# Altium project SPI LVDS Master.PrjPcb
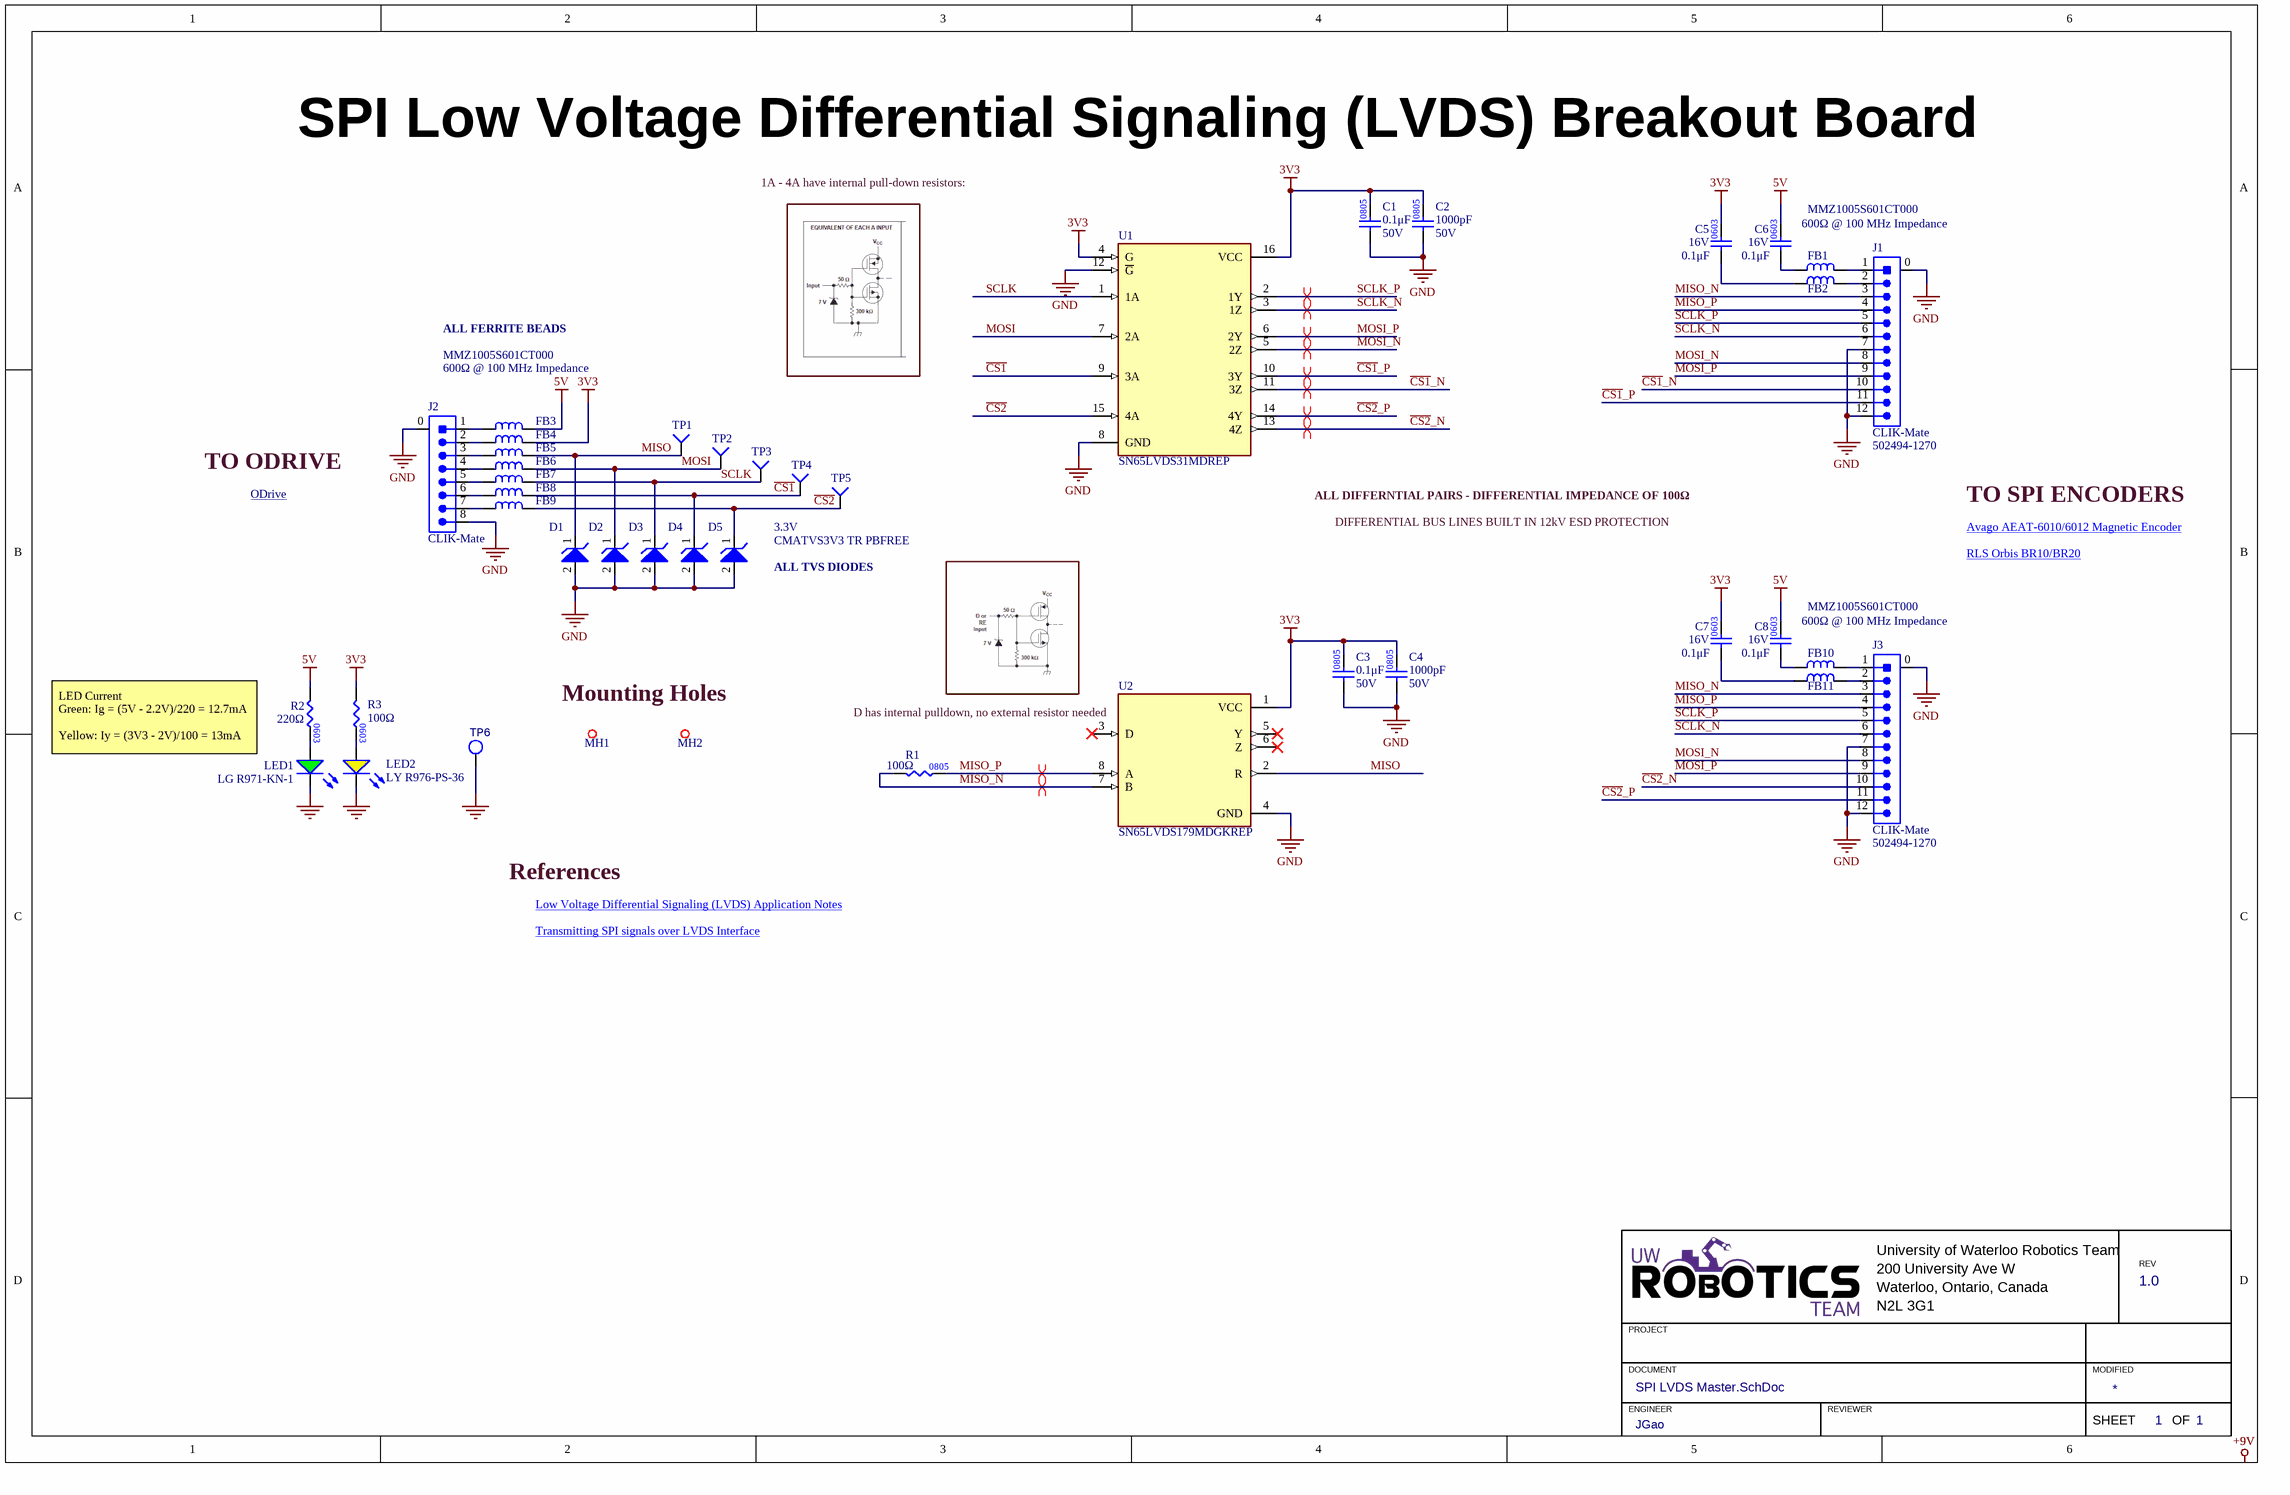
[diagram p0: SPI LVDS Master.SchDoc]
Engineer: JGao; Revision: 1.0
1 sheet, 42 parts. Net scope: global (net labels, ports and power ports of the same name join across sheets).
Board file: SPI LVDS Master.PcbDoc

## Sheet SPI LVDS Master.SchDoc: SPI Low Voltage Differential Signaling (LVDS) Breakout Board
size 431 x 279 mm; Engineer: JGao; Organization: TESLA Motors, INC; Address1: 3500 Deer Creek Road; Address2: Palo Alto, CA; Address4: U.S.A.; SheetNumber: 1; SheetTotal: 1

### Parts
C1  value 0.1μF  Voltage Rating: 50V  [CAP2012]  (hidden comment: CAP_0.1uF_50V_0805)
C2  value 1000pF  Voltage Rating: 50V  [CAP2012]  (hidden comment: CAP_1000pF_50V_0805)
C3  value 0.1μF  Voltage Rating: 50V  [CAP2012]  (hidden comment: CAP_0.1uF_50V_0805)
C4  value 1000pF  Voltage Rating: 50V  [CAP2012]  (hidden comment: CAP_1000pF_50V_0805)
C5  value 0.1μF  Voltage Rating: 16V  [CAP0603]  (hidden comment: CAP_0.1uF_16V_0603)
C6  value 0.1μF  Voltage Rating: 16V  [CAP0603]  (hidden comment: CAP_0.1uF_16V_0603)
C7  value 0.1μF  Voltage Rating: 16V  [CAP0603]  (hidden comment: CAP_0.1uF_16V_0603)
C8  value 0.1μF  Voltage Rating: 16V  [CAP0603]  (hidden comment: CAP_0.1uF_16V_0603)
D1  Voltage - Reverse Standoff (Typ): 3.3V  Manufacturer Part Number 1: CMATVS3V3 TR PBFREE  [SOD-923]  (hidden comment: TVS_DIODE_UNIDIR_3.3V_7A)
D2  TVS_DIODE_UNIDIR_3.3V_7A  [SOD-923]  (value not drawn)
D3  TVS_DIODE_UNIDIR_3.3V_7A  [SOD-923]  (value not drawn)
D4  TVS_DIODE_UNIDIR_3.3V_7A  [SOD-923]  (value not drawn)
D5  TVS_DIODE_UNIDIR_3.3V_7A  [SOD-923]  (value not drawn)
FB1  Manufacturer Part Number 1: MMZ1005S601CT000  [RES0402]  (hidden comment: FERRITE_BEAD_600OHM_0402)
FB2  FERRITE_BEAD_600OHM_0402  [RES0402]  (value not drawn)
FB3  Manufacturer Part Number 1: MMZ1005S601CT000  [RES0402]  (hidden comment: FERRITE_BEAD_600OHM_0402)
FB4  FERRITE_BEAD_600OHM_0402  [RES0402]  (value not drawn)
FB5  FERRITE_BEAD_600OHM_0402  [RES0402]  (value not drawn)
FB6  FERRITE_BEAD_600OHM_0402  [RES0402]  (value not drawn)
FB7  FERRITE_BEAD_600OHM_0402  [RES0402]  (value not drawn)
FB8  FERRITE_BEAD_600OHM_0402  [RES0402]  (value not drawn)
FB9  FERRITE_BEAD_600OHM_0402  [RES0402]  (value not drawn)
FB10  Manufacturer Part Number 1: MMZ1005S601CT000  [RES0402]  (hidden comment: FERRITE_BEAD_600OHM_0402)
FB11  FERRITE_BEAD_600OHM_0402  [RES0402]  (value not drawn)
J1  Family: CLIK-Mate  Supplier Part Number 1: 502494-1270  [MOLEX-5024941270]  (hidden comment: CON_12M_SM_RA_2mm)
J2  Family: CLIK-Mate  [MOLEX-5025850870]  (hidden comment: CON_8M_SM_RA)
J3  Family: CLIK-Mate  Supplier Part Number 1: 502494-1270  [MOLEX-5024941270]  (hidden comment: CON_12M_SM_RA_2mm)
LED1  Manufacturer Part Number 1: LG R971-KN-1  [LED_0805_GREEN]  (hidden comment: LED_GREEN)
LED2  Manufacturer Part Number 1: LY R976-PS-36  [LED_0805_YELLOW]  (hidden comment: LED_YELLOW)
MH1  MOUNTING_HOLE_M3  [MOUNTING_HOLE_3mm]  (value not drawn)  (no BOM)
MH2  MOUNTING_HOLE_M3  [MOUNTING_HOLE_3mm]  (value not drawn)  (no BOM)
R1  value 100Ω  [RES0805]  (hidden comment: RES_100Ω_0805_1%)
R2  value 220Ω  [RES0603]  (hidden comment: RES_220Ω_0603_5%)
R3  value 100Ω  [RES0603]  (hidden comment: RES_100Ω_0603_1%)
TP1  TESTPOINT_1MM_SQUARE  [TESTPOINT_SQUARE_1MM]  (value not drawn)  (no BOM)
TP2  TESTPOINT_1MM_SQUARE  [TESTPOINT_SQUARE_1MM]  (value not drawn)  (no BOM)
TP3  TESTPOINT_1MM_SQUARE  [TESTPOINT_SQUARE_1MM]  (value not drawn)  (no BOM)
TP4  TESTPOINT_1MM_SQUARE  [TESTPOINT_SQUARE_1MM]  (value not drawn)  (no BOM)
TP5  TESTPOINT_1MM_SQUARE  [TESTPOINT_SQUARE_1MM]  (value not drawn)  (no BOM)
TP6  TESTPOINT_LOOP  [TESTPOINT_LOOP]  (value not drawn)
U1  SN65LVDS31MDREP  [SOIC127P600X175-16N]
U2  SN65LVDS179MDGKREP  [SOP65P490X110-8N]

### Nets
3V3: C1.2 C2.2 C3.2 C4.2 C5.2 C7.2 FB4.2 R3.1 U1.4(G) U1.16(VCC) U2.1(VCC)
5V: C6.2 C8.2 FB3.2 R2.1
GND: C1.1 C2.1 C3.1 C4.1 D1.2 D2.2 D3.2 D4.2 D5.2 J1.0 J1.7 J1.12 J2.0 J2.8 J3.0 J3.7 J3.12 LED1.2(K) LED2.2(K) TP6.1 U1.8(GND) U1.12(~{G}) U2.4(GND)
~{CS1}: D4.1 FB8.2 TP4.1(=value) U1.9(3A)
~{CS1}_N: J1.10 U1.11(3Z)
~{CS1}_P: J1.11 U1.10(3Y)
~{CS2}: D5.1 FB9.2 TP5.1(=value) U1.15(4A)
~{CS2}_N: J3.10 U1.13(4Z)
~{CS2}_P: J3.11 U1.14(4Y)
MISO: D1.1 FB5.2 TP1.1(=value) U2.2(R)
MISO_N: J1.3 J3.3 R1.1 U2.7(B)
MISO_P: J1.4 J3.4 R1.2 U2.8(A)
MOSI: D2.1 FB6.2 TP2.1(=value) U1.7(2A)
MOSI_N: J1.8 J3.8 U1.5(2Z)
MOSI_P: J1.9 J3.9 U1.6(2Y)
SCLK: D3.1 FB7.2 TP3.1(=value) U1.1(1A)
SCLK_N: J1.6 J3.6 U1.3(1Z)
SCLK_P: J1.5 J3.5 U1.2(1Y)
NetC5_1: C5.1 FB2.2
NetC6_1: C6.1 FB1.2
NetC7_1: C7.1 FB11.2
NetC8_1: C8.1 FB10.2
NetFB1_1: FB1.1 J1.1
NetFB2_1: FB2.1 J1.2
NetFB3_1: FB3.1 J2.1
NetFB4_1: FB4.1 J2.2
NetFB5_1: FB5.1 J2.3
NetFB6_1: FB6.1 J2.4
NetFB7_1: FB7.1 J2.5
NetFB8_1: FB8.1 J2.6
NetFB9_1: FB9.1 J2.7
NetFB10_1: FB10.1 J3.1
NetFB11_1: FB11.1 J3.2
NetLED1_1: LED1.1(A) R2.2
NetLED2_1: LED2.1(A) R3.2

Not connected (* = marked no-connect by the designer): U2 3(D)* 5(Y)* 6(Z)*

### Layout directives
differential pair: MISO_N, MISO_P, MOSI_N, MOSI_P, SCLK_N, SCLK_P, ~{CS1}_N, ~{CS1}_P, ~{CS2}_N, ~{CS2}_P

### Notes on the sheet
- 1A - 4A have internal pull-down resistors:
- (near C6) 600Ω @ 100 MHz Impedance
- ALL FERRITE BEADS
- 600Ω @ 100 MHz Impedance
- TO ODRIVE
- ALL DIFFERNTIAL PAIRS - DIFFERENTIAL IMPEDANCE OF 100Ω
- ODrive <https://odriverobotics.com/>
- DIFFERENTIAL BUS LINES BUILT IN 12kV ESD PROTECTION
- TO SPI ENCODERS
- Avago AEAT-6010/6012 Magnetic Encoder <https://www.mouser.ca/datasheet/2/678/av02_0188en-1855336.pdf>
- RLS Orbis BR10/BR20 <https://www.rls.si/eng/fileuploader/download/download/?d=1&file=custom%2Fupload%2FBRD01_08_EN_data_sheet.pdf>
- (near D5) ALL TVS DIODES
- (near C8) 600Ω @ 100 MHz Impedance
- LED Current
  Green: Ig = (5V - 2.2V)/220 = 12.7mA
  Yellow: Iy = (3V3 - 2V)/100 = 13mA
- Mounting Holes
- (near U2) D has internal pulldown, no external resistor needed
- References
- Low Voltage Differential Signaling (LVDS) Application Notes <https://www.ti.com/lit/an/slla014a/slla014a.pdf?ts=1641520445544>
- Transmitting SPI signals over LVDS Interface <https://www.ti.com/lit/ug/tidued8/tidued8.pdf?ts=1641492246613>
- University of Waterloo Robotics Team
- 200 University Ave W
- REV
- PROJECT
- Waterloo, Ontario, Canada
- N2L 3G1
- DOCUMENT
- ENGINEER
- REVIEWER
- MODIFIED
- SHEET
- OF
- (in symbol RES_100Ω_0603_1%) 0603

### Library data of the parts
C1 C3 = CAP_0.1uF_50V_0805: CAP CER 0.1UF 50V X7R 0805; Manufacturer 1: Murata Electronics; Manufacturer Part Number 1: GCM21BR71H104KA37K; Package/Footprint: 0805; Mounting Type: SMD; Supplier 1: Digi-Key; Supplier Part Number 1: 490-8049-1-ND; Dielectric: X7R; LCSC Part #: C49678
C2 C4 = CAP_1000pF_50V_0805: CAP CER 1000pF 50V X7R 0805; Manufacturer 1: Samsung; Manufacturer Part Number 1: CL21B102KBANNNC; Package/Footprint: 0805; Supplier 1: Digi-Key; Mounting Type: SMD; Supplier Part Number 1: 1276-1020-1-ND; Dielectric: X7R
C5-C8 = CAP_0.1uF_16V_0603: CAP CER 0.1UF 16V X7R 0603; Manufacturer Part Number 1: CC0603KRX7R7BB104; Manufacturer 1: Yageo; Package: 0603; Supplier Part Number 1: 311-1088-1-ND; Supplier 1: Digi-Key; Dielectric: X7R
D1 = TVS_DIODE_UNIDIR_3.3V_7A: TVS DIODE 3.3VWM 11VC SOD923; Manufacturer 1: Central Semiconductor Corp; Voltage - Breakdown (Min): 5V; Voltage - Clamping (Max) @ Ipp: 11V; Mounting Type: SMD; Package/Footprint: SOD-923; Supplier 1: Digi-Key; Supplier Part Number 1: 1514-CMATVS3V3TRPBFREECT-ND
D2-D5 = TVS_DIODE_UNIDIR_3.3V_7A: TVS DIODE 3.3VWM 11VC SOD923; Manufacturer 1: Central Semiconductor Corp; Manufacturer Part Number 1: CMATVS3V3 TR PBFREE; Voltage - Breakdown (Min): 5V; Voltage - Clamping (Max) @ Ipp: 11V; Voltage - Reverse Standoff (Typ): 3.3V; Mounting Type: SMD; Package/Footprint: SOD-923; Supplier 1: Digi-Key; Supplier Part Number 1: 1514-CMATVS3V3TRPBFREECT-ND
FB1 FB3 FB10 = FERRITE_BEAD_600OHM_0402: FIXED IND 1UH 3.8A 33 MOHM SMD; Manufacturer 1: TDK Corporation; DC Resistance (DCR) (Max): 520mΩ; Current Rating (Max): 300mA; Impedance @ Frequency: 600Ω @ 100 MHz; Impedance: 600Ω; Supplier Part Number 1: 445-2162-1-ND; Supplier 1: Digi-Key; Mounting Type: SMD; Package/Footprint: SMD; Package: 0402
FB2 FB4-FB9 FB11 = FERRITE_BEAD_600OHM_0402: FIXED IND 1UH 3.8A 33 MOHM SMD; Manufacturer 1: TDK Corporation; Manufacturer Part Number 1: MMZ1005S601CT000; DC Resistance (DCR) (Max): 520mΩ; Current Rating (Max): 300mA; Impedance @ Frequency: 600Ω @ 100 MHz; Impedance: 600Ω; Supplier Part Number 1: 445-2162-1-ND; Supplier 1: Digi-Key; Mounting Type: SMD; Package/Footprint: SMD; Package: 0402
J1 J3 = CON_12M_SM_RA_2mm: 2.00mm Pitch CLIK-Mate Wire-to-Board PCB Receptacle, Single Row, Right-Angle, 12 Circuits; Manufacturer: Molex; Number of Contacts: 12; Contact Resistance: 20mR; Current Rating: 3A; Mating Cycles: 30; Voltage Rating (AC): 250V; Insulation Resistance: 1GR; Pitch: 2mm; Glow Wire Compliant: Non-compliant; Supplier 1: Mouser; Manufacturer Part Number: 502494-1270; RoHS: Yes; Category: Headers and Wire Housings; Stock 1: 1900; Pricing 1: 950=0.62780, 1900=0.61060, 3800=0.56580, 5700=0.53600, 7600=0.52000 (USD); Mount: Surface Mount; Color: Natural,White; Contact Plating: Tin; Contact Material: Copper Alloy; Housing Material: PBT; Material: Polybutylene; Housing Color: Natural; Min Operating Temperature: -25°C; Max Operating Temperature: 85°C; Number of Rows: 1; Termination: Solder; Fastening Type: Latch; Packaging: Tape and Reel; Contact Gender: Female; Package Quantity: 950; Connector Type: Receptacle; Number of Positions: 12; Max Voltage Rating (AC): 250V; Max Voltage Rating (DC): 250V; Gender: Receptacle; Orientation: Right Angle; Number of Circuits: 12; Series: 502494; Contact Type: Center Strip Contact; Length: 28mm; Lead Pitch: 2mm; Depth: 6.85mm; Radiation Hardening: No; REACH SVHC: Unknown; Flammability Rating: UL94 V-0
J2 = CON_8M_SM_RA: CONN HEADER SMD RIGHT ANGLE 1.5 MM PITCH; Current Rating: 2A; Voltage Rating: 100V; Pitch: 1.5mm; Supplier 1: Digi-Key; Mounting Type: SMD; Package/Footprint: SMD; Orientation: Right Angle; Supplier Part Number 1: WM14471CT-ND
LED1 = LED_GREEN: LED GREEN DIFFUSED 0805 SMD; Manufacturer 1: OSRAM; Forward Voltage Drop: 2.2V; Package/Footprint: 0805; Supplier Part Number 1: 475-1410-1-ND; Supplier 1: Digi-Key; Mounting Type: SMD
LED2 = LED_YELLOW: LED YELLOW DIFFUSED 0805 SMD; Manufacturer 1: OSRAM; Forward Voltage Drop: 2.2V; Package: 0805 (2012 Metric); Supplier Part Number 1: 475-2560-1-ND; Supplier 1: Digi-Key
R1 = RES_100Ω_0805_1%: RES 100 OHM 1% 1/8W 0805; Manufacturer 1: Vishay Dale; Manufacturer Part Number 1: CRCW0805100RFKEA; Package/Footprint: 0805; Supplier 1: Digi-Key; Mounting Type: SMD; Supplier Part Number 1: 541-100CCT-ND; LCSC Part #: C1790
R2 = RES_220Ω_0603_5%: RES 220 OHM 5% 1/10W 0603; Manufacturer 1: Yageo; Manufacturer Part Number 1: AC0603JR-07220RL; Package/Footprint: 0603; Supplier Part Number 1: YAG3652CT-ND; Supplier 1: Digi-Key
R3 = RES_100Ω_0603_1%: RES 100 OHM 1% 1/10W 0603; Manufacturer 1: Yageo; Manufacturer Part Number 1: RC0603FR-07100RL; Supplier Part Number 1: 311-100HRCT-ND; Supplier 1: Digi-Key
TP1-TP5 = TESTPOINT_1MM_SQUARE: TESTPOINT 1MM SQUARE
TP6 = TESTPOINT_LOOP: TESTPOINT THRUHOLE; Manufacturer 1: Keystone Electronics; Manufacturer Part Number 1: 5002; Package/Footprint: TH; Supplier Part Number 1: 36-5002-ND; Supplier 1: Digi-Key; Mounting Type: TH
U1 = SN65LVDS31MDREP: IC DRIVER 4/0 16SOIC; Package: None; Price: None; Value: *; MP: SN65LVDS31MDREP; Availability: Unavailable; Supplier 1: Digi-Key; Supplier Part Number 1: 296-36715-1-ND
U2 = SN65LVDS179MDGKREP: Enhanced Product High-Speed Differential Line Drivers And Receivers 8-VSSOP -55 to 125; MF: Texas Instruments; Package: VSSOP-8 Texas Instruments; Purchase-URL: https://pricing.snapeda.com/search/part/SN65LVDS179MDGKREP/?ref=eda; Digi-Key_Part_Number: 296-22243-1-ND; Value: *; SnapEDA_Link: https://www.snapeda.com/parts/SN65LVDS179MDGKREP/Texas%20Instruments/view-part/383554/?ref=snap; MP: SN65LVDS179MDGKREP; Supplier 1: Digi-Key; Supplier Part Number 1: 296-22243-1-ND